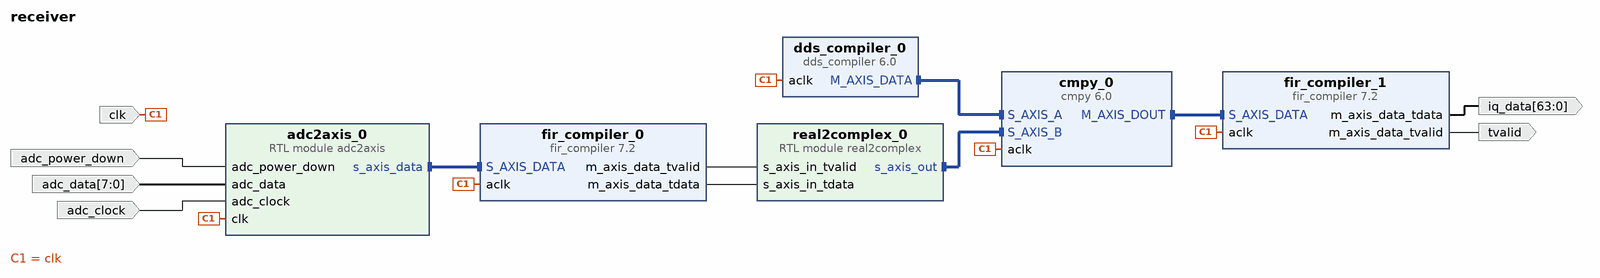
[diagram p0: block diagram of the top level]
# Vivado block design receiver, xc7s6ftgb196-1, Vivado 2020.2
create_bd_design receiver

create_bd_port -dir I -from 7 -to 0 -type data adc_data
create_bd_port -dir I -type clk adc_clock
set_property -dict {CONFIG.FREQ_HZ 8000000} [get_bd_ports adc_clock]
create_bd_port -dir I -type ce adc_power_down
create_bd_port -dir I -type clk clk
set_property -dict {CONFIG.FREQ_HZ 125000000} [get_bd_ports clk]
create_bd_port -dir O -from 63 -to 0 -type data iq_data
create_bd_port -dir O tvalid

create_bd_cell -type ip -vlnv xilinx.com:ip:fir_compiler:7.2 fir_compiler_0
set_property -dict [list \
  CONFIG.Clock_Frequency 125 \
  CONFIG.CoefficientVector 1,1,1 \
  CONFIG.Coefficient_Fractional_Bits 0 \
  CONFIG.Coefficient_Sets 1 \
  CONFIG.Coefficient_Sign Unsigned \
  CONFIG.Coefficient_Structure Inferred \
  CONFIG.Coefficient_Width 16 \
  CONFIG.Data_Sign Unsigned \
  CONFIG.Data_Width 8 \
  CONFIG.Filter_Architecture Systolic_Multiply_Accumulate \
  CONFIG.Output_Rounding_Mode Full_Precision \
  CONFIG.Output_Width 10 \
  CONFIG.Quantization Integer_Coefficients \
  CONFIG.Sample_Frequency 8 \
] [get_bd_cells fir_compiler_0]
create_bd_cell -type module -reference adc2axis adc2axis_0
create_bd_cell -type ip -vlnv xilinx.com:ip:dds_compiler:6.0 dds_compiler_0
set_property -dict [list \
  CONFIG.DATA_Has_TLAST Not_Required \
  CONFIG.DDS_Clock_Rate 125 \
  CONFIG.Frequency_Resolution 0.4 \
  CONFIG.Has_Phase_Out false \
  CONFIG.Latency 3 \
  CONFIG.M_DATA_Has_TUSER Not_Required \
  CONFIG.Noise_Shaping None \
  CONFIG.Output_Frequency1 0 \
  CONFIG.Output_Width 8 \
  CONFIG.PINC1 0 \
  CONFIG.Parameter_Entry Hardware_Parameters \
  CONFIG.PartsPresent Phase_Generator_and_SIN_COS_LUT \
  CONFIG.Phase_Width 16 \
  CONFIG.S_PHASE_Has_TUSER Not_Required \
] [get_bd_cells dds_compiler_0]
create_bd_cell -type ip -vlnv xilinx.com:ip:cmpy:6.0 cmpy_0
create_bd_cell -type module -reference real2complex real2complex_0
create_bd_cell -type ip -vlnv xilinx.com:ip:fir_compiler:7.2 fir_compiler_1
set_property -dict [list \
  CONFIG.Clock_Frequency 125 \
  CONFIG.CoefficientVector 1,1,1 \
  CONFIG.Coefficient_Fractional_Bits 0 \
  CONFIG.Coefficient_Sets 1 \
  CONFIG.Coefficient_Sign Unsigned \
  CONFIG.Coefficient_Structure Inferred \
  CONFIG.Coefficient_Width 16 \
  CONFIG.DATA_Has_TLAST Not_Required \
  CONFIG.Filter_Architecture Systolic_Multiply_Accumulate \
  CONFIG.M_DATA_Has_TUSER Not_Required \
  CONFIG.Number_Channels 2 \
  CONFIG.Number_Paths 2 \
  CONFIG.Output_Rounding_Mode Full_Precision \
  CONFIG.Output_Width 27 \
  CONFIG.Quantization Integer_Coefficients \
  CONFIG.S_DATA_Has_TUSER Not_Required \
  CONFIG.Sample_Frequency 8 \
  CONFIG.Select_Pattern All \
] [get_bd_cells fir_compiler_1]

# ---- connections ----

connect_bd_intf_net [get_bd_intf_pins fir_compiler_1/S_AXIS_DATA] [get_bd_intf_pins cmpy_0/M_AXIS_DOUT]
connect_bd_intf_net [get_bd_intf_pins cmpy_0/S_AXIS_B] [get_bd_intf_pins real2complex_0/s_axis_out]
connect_bd_intf_net [get_bd_intf_pins fir_compiler_0/S_AXIS_DATA] [get_bd_intf_pins adc2axis_0/s_axis_data]
connect_bd_intf_net [get_bd_intf_pins cmpy_0/S_AXIS_A] [get_bd_intf_pins dds_compiler_0/M_AXIS_DATA]
connect_bd_net [get_bd_ports clk] \
  [get_bd_pins fir_compiler_0/aclk] [get_bd_pins adc2axis_0/clk] [get_bd_pins dds_compiler_0/aclk] [get_bd_pins cmpy_0/aclk] \
  [get_bd_pins fir_compiler_1/aclk]
connect_bd_net [get_bd_ports adc_power_down] [get_bd_pins adc2axis_0/adc_power_down]
connect_bd_net [get_bd_ports adc_data] [get_bd_pins adc2axis_0/adc_data]
connect_bd_net [get_bd_ports adc_clock] [get_bd_pins adc2axis_0/adc_clock]
connect_bd_net [get_bd_pins fir_compiler_1/m_axis_data_tdata] [get_bd_ports iq_data]
connect_bd_net [get_bd_pins fir_compiler_1/m_axis_data_tvalid] [get_bd_ports tvalid]
connect_bd_net [get_bd_pins fir_compiler_0/m_axis_data_tvalid] [get_bd_pins real2complex_0/s_axis_in_tvalid]
connect_bd_net [get_bd_pins fir_compiler_0/m_axis_data_tdata] [get_bd_pins real2complex_0/s_axis_in_tdata]

validate_bd_design
save_bd_design
